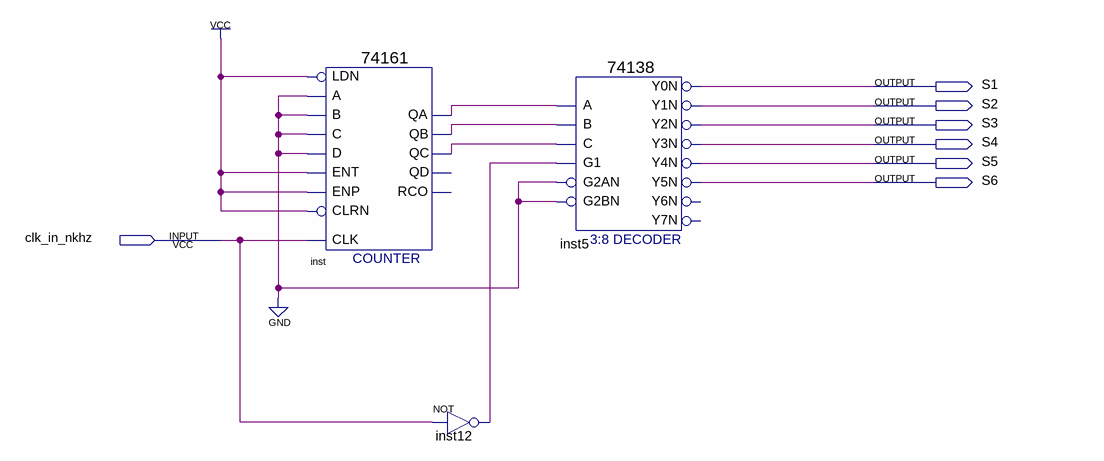
[diagram p0: schematic sheet]
// Quartus schematic shunxumaichong.bdf as structural Verilog: 3 symbols, 7 pins
module shunxumaichong (
  input  clk_in_nkhz,
  output S1,
  output S2,
  output S3,
  output S4,
  output S5,
  output S6
);

  wire inst12_out, inst_qa, inst_qb, inst_qc;

  \74161  inst (
    .CLRN(1'b1), .CLK(clk_in_nkhz), .ENP(1'b1), .LDN(1'b1), .A(1'b0), .D(1'b0), .ENT(1'b1), .B(1'b0),
    .C(1'b0), .QC(inst_qc), .QB(inst_qb), .QA(inst_qa));  // open: QD, RCO
  not inst12 (inst12_out, clk_in_nkhz);
  \74138  inst5 (
    .A(inst_qa), .B(inst_qb), .G1(inst12_out), .C(inst_qc), .G2AN(1'b0), .G2BN(1'b0), .Y0N(S1), .Y1N(S2),
    .Y2N(S3), .Y3N(S4), .Y4N(S5), .Y5N(S6));  // open: Y6N, Y7N
endmodule
